# EAGLE design 1-Wire_Sniffer_REV1 (EAGLE 6.5.0)
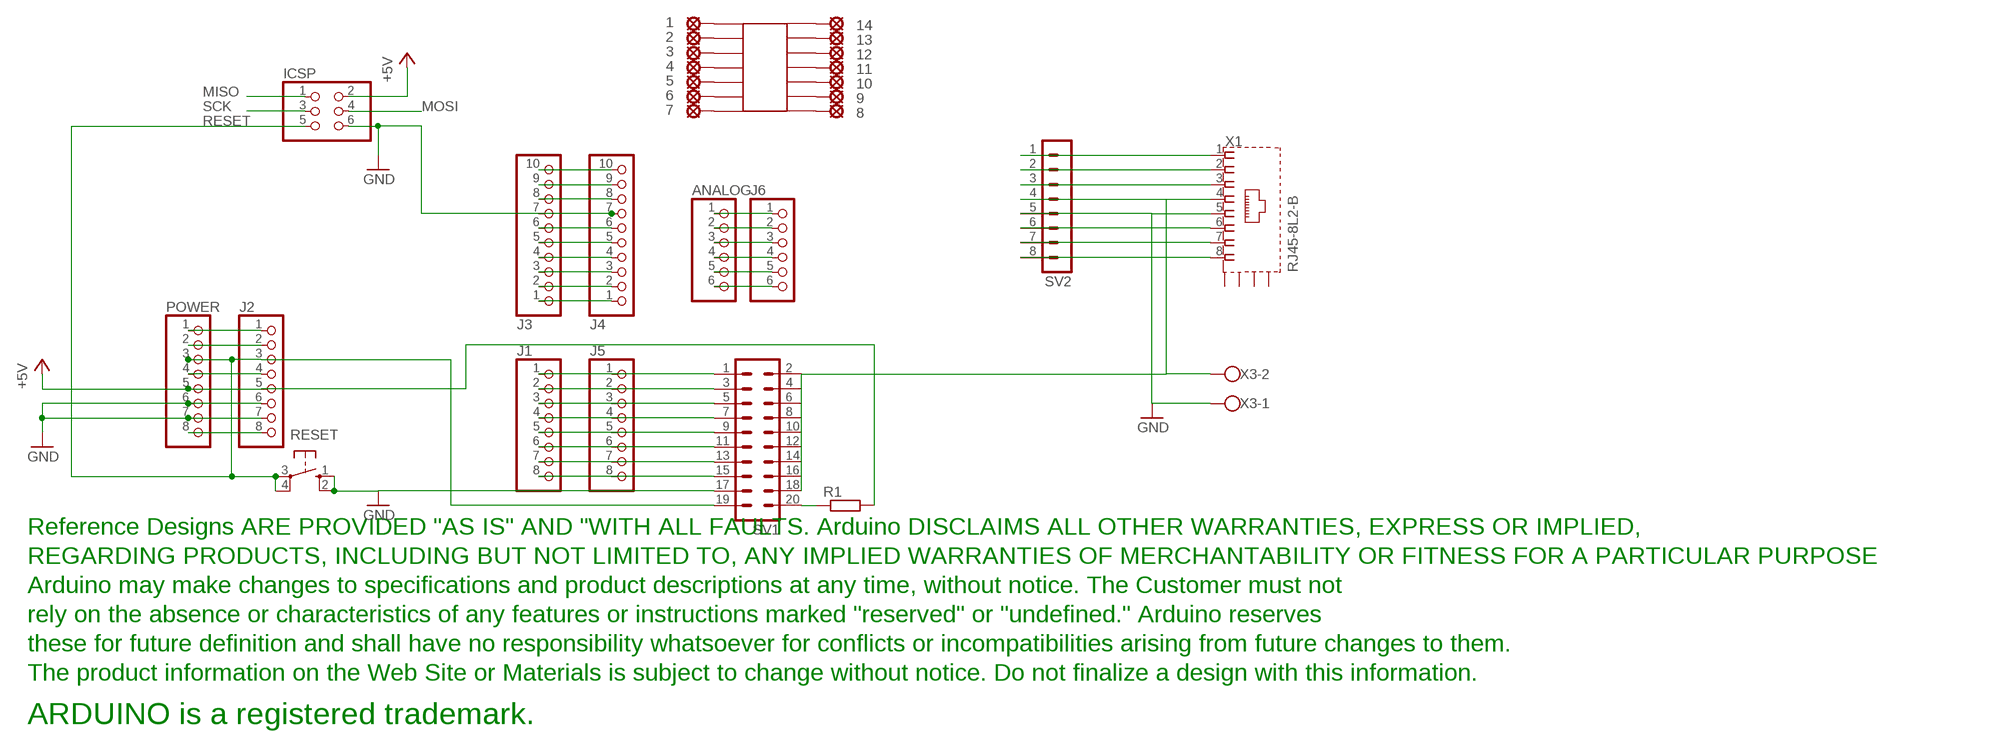
[diagram p0: schematic, sheet 1]

## Parts
1  LSP10  [LSP10]
2  LSP10  [LSP10]
3  LSP10  [LSP10]
4  LSP10  [LSP10]
5  LSP10  [LSP10]
6  LSP10  [LSP10]
7  LSP10  [LSP10]
8  LSP10  [LSP10]
9  LSP10  [LSP10]
10  LSP10  [LSP10]
11  LSP10  [LSP10]
12  LSP10  [LSP10]
13  LSP10  [LSP10]
14  LSP10  [LSP10]
ANALOG  PINHD-1X6  [1X06]
IC2  SMD-14  [SO-14NMW]
ICSP  PINHD-2X3  [2X03]
J1  PINHD-1X8TH  [1X08-TH]
J2  PINHD-1X8TH  [1X08-TH]
J3  PINHD-1X10TH  [1X10-TH]
J4  PINHD-1X10TH  [1X10-TH]
J5  PINHD-1X8TH  [1X08-TH]
J6  PINHD-1X6  [1X06]
POWER  PINHD-1X8TH  [1X08-TH]
R1  R-EU_0207/10  [0207/10]
RESET  10-XX  [B3F-10XX]
SV1  MA10-2  [MA10-2]
SV2  MA08-1  [MA08-1]
U$1  DISCLAIMER  [DISCLAIMER]
X1  RJ45-8L2-B  [RJ45-SHIELD2]
X3  W237-102  [W237-102]

## Nets
+5V: ICSP.2 J2.5 POWER.5 R1.2
+9V: J2.8 POWER.8
GND: ICSP.6 J2.7 J3.7 J4.7 POWER.7 RESET.1(S) RESET.2(S1) SV1.17 SV2.5 X1.5 X3.1
MISO: ICSP.1
MOSI: ICSP.4
N$1: J3.6 J4.6
N$2: J3.1 J4.1
N$3: J3.4 J4.4
N$4: J3.5 J4.5
N$5: SV1.2 SV1.4 SV1.6 SV1.8 SV1.10 SV1.12 SV1.14 SV1.16 SV1.18 SV2.4 X1.4 X3.2
N$6: J3.2 J4.2
N$7: J3.3 J4.3
N$8: J1.1 J5.1 SV1.1
N$9: J1.2 J5.2 SV1.3
N$10: J1.3 J5.3 SV1.5
N$11: J1.4 J5.4 SV1.7
N$12: J1.5 J5.5 SV1.9
N$13: J1.6 J5.6 SV1.11
N$14: J1.7 J5.7 SV1.13
N$15: J1.8 J5.8 SV1.15
N$16: SV2.1 X1.1
N$17: SV2.2 X1.2
N$18: ANALOG.1 J6.1
N$19: ANALOG.2 J6.2
N$20: ANALOG.3 J6.3
N$21: ANALOG.4 J6.4
N$22: ANALOG.5 J6.5
N$23: ANALOG.6 J6.6
N$24: 14.MP IC2.P$14
N$25: SV2.3 X1.3
N$31: J2.2 POWER.2
N$32: J2.1 POWER.1
N$38: SV2.6 X1.6
N$50: SV2.7 X1.7
N$52: SV2.8 X1.8
N$97: 13.MP IC2.P$13
N$98: 12.MP IC2.P$12
N$99: 11.MP IC2.P$11
N$100: 10.MP IC2.P$10
N$101: 9.MP IC2.P$9
N$102: 8.MP IC2.P$8
N$103: 7.MP IC2.P$7
N$104: 6.MP IC2.P$6
N$109: 5.MP IC2.P$5
N$110: 3.MP IC2.P$3
N$111: 2.MP IC2.P$2
N$112: 1.MP IC2.P$1
N$113: 4.MP IC2.P$4
N$141: J3.9 J4.9
N$142: J3.10 J4.10
N$144: R1.1 SV1.20
N$145: J2.6 POWER.6
N$222: J3.8 J4.8
N$223: J2.4 POWER.4
RESET: ICSP.5 J2.3 POWER.3 RESET.3(P) RESET.4(P1) SV1.19
SCK: ICSP.3
Unconnected: X1.S1(S) X1.S2(S) X1.S3(S) X1.S4(S)

## Library data of the parts
1-14 = SmartPrj:LSP10: SOLDER PAD drill 1.0 mm, distributor Buerklin, 12H555
ANALOG J6 = pinhead:PINHD-1X6: PIN HEADER
IC2 = carduino:SMD-14
ICSP = SmartPrj:PINHD-2X3: PIN HEADER
J1 J2 J5 POWER = SmartPrj:PINHD-1X8: PIN HEADER
J3 J4 = SmartPrj:PINHD-1X10: PIN HEADER
R1 = rcl:R-EU_: RESISTOR, European symbol
RESET = switch-omron:10-XX: OMRON SWITCH
SV1 = con-lstb:MA10-2: PIN HEADER; OC_FARNELL: unknown; OC_NEWARK: unknown
SV2 = con-lstb:MA08-1: PIN HEADER; OC_FARNELL: unknown; OC_NEWARK: unknown
U$1 = SmartPrj:DISCLAIMER
X1 = con-tycoelectronics:RJ45*2: RJ45 Low Profile Shield Type 2 For all RJ45 L, LC, LCT and X Series Models Source: www.tycoelectronics.com .. ENG_DS_1654001_1099_RJ_L_0507.pdf; MF: TYCO ELECTRONICS; MPN: RJ45-8L2-B; OC_FARNELL: unknown; OC_NEWARK: 52K3810
X3 = con-wago-500:W237-102: WAGO SCREW CLAMP; MPN: 237-102; OC_FARNELL: unknown; OC_NEWARK: 70K9898

## Board
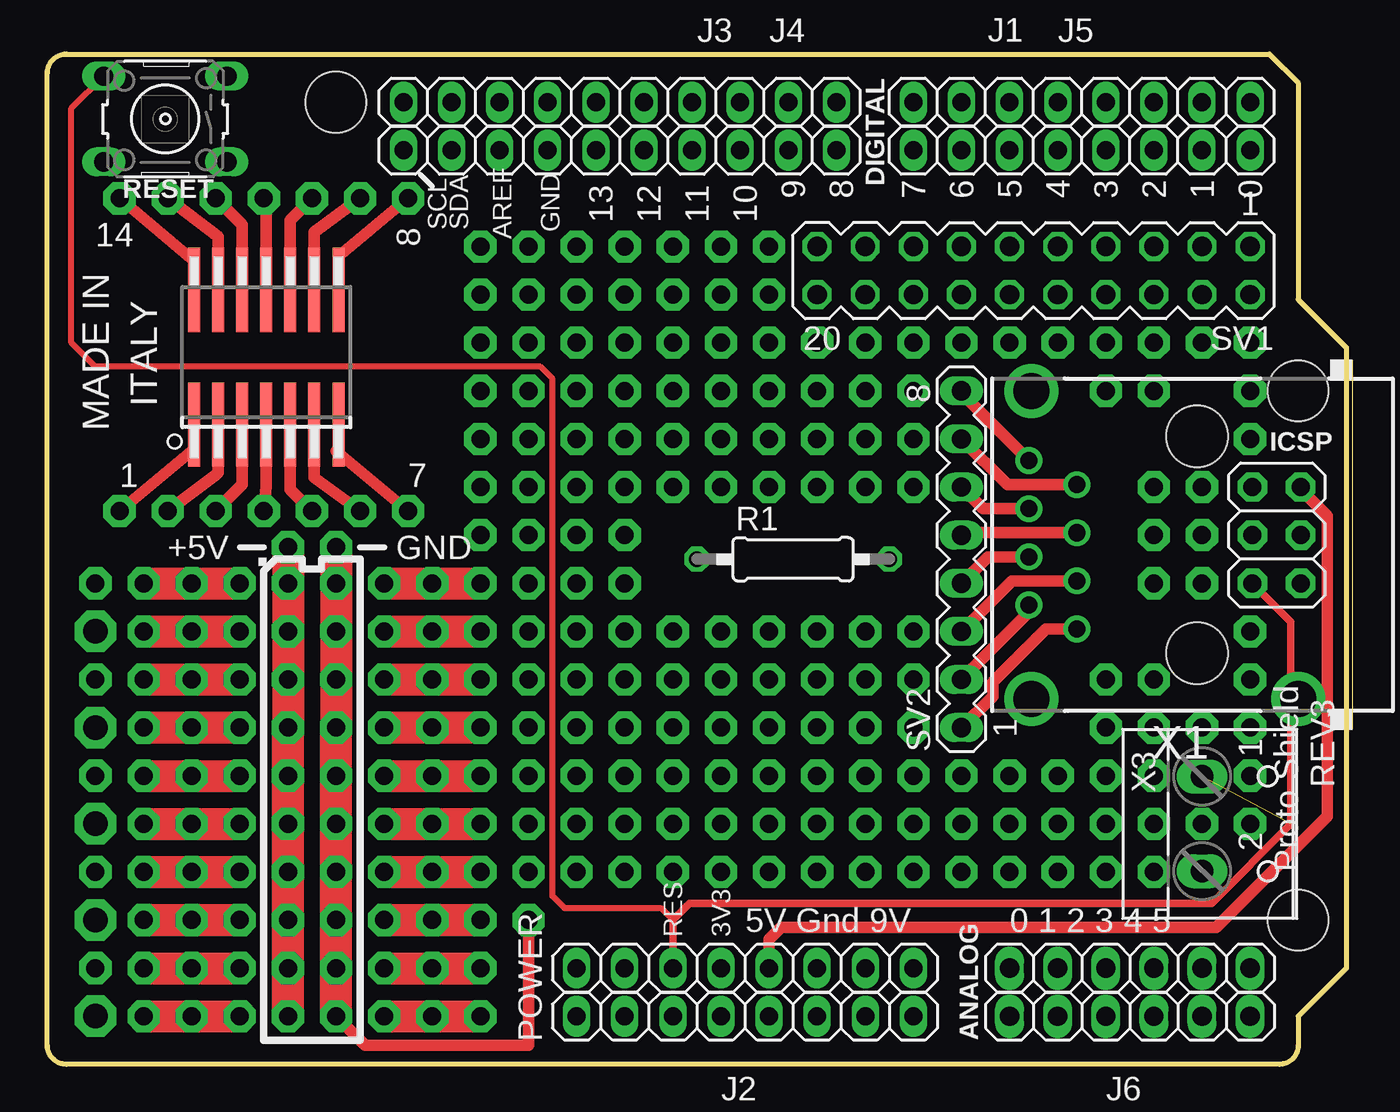
[diagram p1: board, top side]
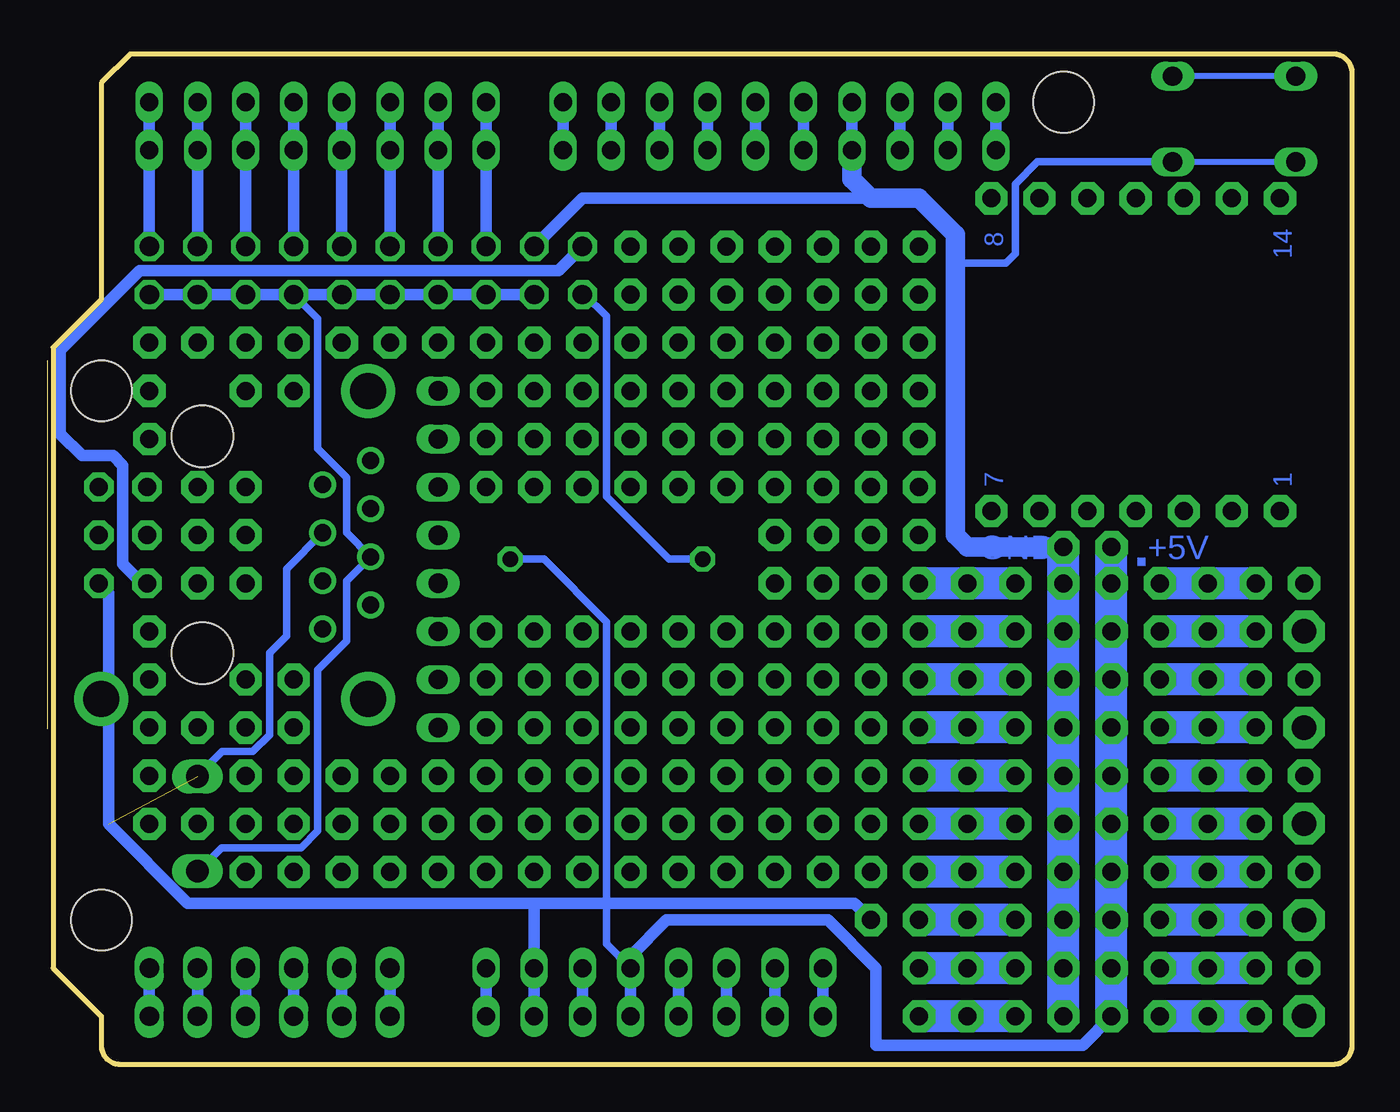
[diagram p2: board, bottom side, seen from below]

Size 68.58 x 53.34 mm. Coordinates in mm from the lower left corner, seen from the top.
Outline: 64.52,53.34 66.04,51.82 66.04,40.39 68.58,37.85 68.58,5.08 66.04,2.54 66.04,1 arc-90 65.04,0 1,0 arc-90 0,1 0,52.34 arc-90 1,53.34 64.52,53.34
Copper layers (1*16): Top 0.035mm / dielectric 1.5mm / Bottom 0.035mm
Design rules "default *": minimum track width 10mil, minimum drill 24mil, track to track 8mil, track to pad 8mil, pad to pad 8mil, via to via 8mil, smd to smd 8mil, copper to edge 40mil, drill to drill 8mil, minimum pad ring 10mil, minimum via ring 8mil, stop-mask expansion 2mil, vias tented up to drill 0mil, thermal gap 10mil
Holes 3.2 mm at 15.24,50.8 66.04,7.62 66.04,35.56

### Footprints (pad centres in the part's own frame; a part is rotated, then mirrored left to right if it is on the bottom)
LSP10 = drill 0.95 pad 1.7 octagon: MP 0,0
1X06 = drill 1.016 long: 1 -6.35,0; 2 -3.81,0; 3 -1.27,0; 4 1.27,0; 5 3.81,0; 6 6.35,0
SO-14NMW = smd 0.635 x 4.445: P$1 -3.048,-3.683; P$2 -1.778,-3.683; P$3 -0.508,-3.683; P$4 0.762,-3.683; P$5 2.032,-3.683; P$6 3.302,-3.683; P$7 4.572,-3.683; P$8 4.572,3.429; P$9 3.302,3.429; P$10 2.032,3.429; P$11 0.762,3.429; P$12 -0.508,3.429; P$13 -1.778,3.429; P$14 -3.048,3.429
2X03 = drill 0.95 pad 1.55 octagon: 1 -2.54,-1.27; 2 -2.54,1.27; 3 0,-1.27; 4 0,1.27; 5 2.54,-1.27; 6 2.54,1.27
1X08-TH = drill 0.95 pad 1.422 long: 1 -8.89,0; 2 -6.35,0; 3 -3.81,0; 4 -1.27,0; 5 1.27,0; 6 3.81,0; 7 6.35,0; 8 8.89,0
1X10-TH = drill 0.95 pad 1.422 long: 1 -11.43,0; 2 -8.89,0; 3 -6.35,0; 4 -3.81,0; 5 -1.27,0; 6 1.27,0; 7 3.81,0; 8 6.35,0; 9 8.89,0; 10 11.43,0
0207/10 = drill 0.813 octagon: 1 -5.08,0; 2 5.08,0
B3F-10XX = drill 1.016 long: 1 -3.251,2.261; 2 3.251,2.261; 3 -3.251,-2.261; 4 3.251,-2.261
MA10-2 = drill 1.016 octagon: 1 -11.43,-1.27; 2 -11.43,1.27; 3 -8.89,-1.27; 4 -8.89,1.27; 5 -6.35,-1.27; 6 -6.35,1.27; 7 -3.81,-1.27; 8 -3.81,1.27; 9 -1.27,-1.27; 10 -1.27,1.27; 11 1.27,-1.27; 12 1.27,1.27; 13 3.81,-1.27; 14 3.81,1.27; 15 6.35,-1.27; 16 6.35,1.27; 17 8.89,-1.27; 18 8.89,1.27; 19 11.43,-1.27; 20 11.43,1.27
MA08-1 = drill 1.016 long: 1 -8.89,0; 2 -6.35,0; 3 -3.81,0; 4 -1.27,0; 5 1.27,0; 6 3.81,0; 7 6.35,0; 8 8.89,0
RJ45-SHIELD2 = drill 0.9 pad 1.4: 1 -4.445,6.35; 2 -3.175,8.89; 3 -1.905,6.35; 4 -0.635,8.89; 5 0.635,6.35; 6 1.905,8.89; 7 3.175,6.35; 8 4.445,8.89 | drill 1.9 pad 2.5: S1 -8.128,-5.33; S2 8.128,-5.33; S3 -8.128,8.76; S4 8.128,8.76 | hole 3.251: -5.715,0; 5.715,0
W237-102 = drill 1.194 long: 1 -2.5,-1.27; 2 2.5,-1.27

### Placement (x,y rotation side)
1  3.81,29.21 90 top
2  6.35,29.21 90 top
3  8.89,29.21 90 top
4  11.43,29.21 90 top
5  13.97,29.21 90 top
6  16.51,29.21 90 top
7  19.05,29.21 90 top
8  19.05,45.72 90 top
9  16.51,45.72 90 top
10  13.97,45.72 90 top
11  11.43,45.72 90 top
12  8.89,45.72 90 top
13  6.35,45.72 270 top
14  3.81,45.72 270 top
ANALOG  57.15,2.54 0 top
IC2  10.79,37.47 0 top
ICSP  64.9,27.94 270 top
J1  54.61,50.8 180 top
J2  36.83,2.54 0 top
J3  30.23,50.8 180 top
J4  30.23,48.26 180 top
J5  54.61,48.26 180 top
J6  57.15,5.08 0 top
POWER  36.83,5.08 0 top
R1  39.37,26.67 0 top
RESET  6.22,49.91 180 top
SV1  52.07,41.91 180 top
SV2  48.26,26.67 90 top
U$1  -5.97,-23.11 0 top  (outside the outline)
X1  60.71,27.43 90 top
X3  62.23,12.7 270 top

### Tracks (layer width: path | path; a pad name or v marks a point on that pad's centre or on a via)
+5V  (via drill 0.95 pad 1.7)
  Top 0.61: ICSP.2 66.17,30.35 67.56,28.96 67.56,13.08 61.72,7.24 38.73,7.24 38.1,6.6 POWER.5
  Top 1.676: v12.7,2.54 v12.7,5.08 v12.7,7.62 v12.7,10.16 v12.7,12.7 v12.7,15.24 v12.7,17.78 v12.7,20.32 v12.7,22.86 v12.7,25.4 v12.7,27.3
  Bottom 0.406: R1.2 42.67,26.67 39.37,23.37 39.37,6.35 POWER.5
  Bottom 0.61: v12.7,2.54 14.22,1.02 25.15,1.02 25.15,5.08 27.69,7.62 36.2,7.62 38.1,5.71 POWER.5 J2.5
  Bottom 1.676: v12.7,2.54 v12.7,27.3
+9V
  Bottom 0.61: J2.8 POWER.8
GND  (via drill 0.95 pad 1.7)  (1 unrouted)
  Top 0.61: v15.24,2.54 16.76,1.02 25.4,1.02 v25.4,7.62 | X1.5 48.39,28.07 SV2.5
  Top 1.676: v15.24,2.54 v15.24,5.08 v15.24,7.62 v15.24,10.16 v15.24,12.7 v15.24,15.24 v15.24,17.78 v15.24,20.32 v15.24,22.86 v15.24,25.4 v15.24,27.3
  Bottom 0.305: RESET.1 RESET.2
  Bottom 0.406: RESET.1 16.61,47.65 17.78,46.48 17.78,42.8 18.29,42.29 20.95,42.29 | X1.5 56.26,26.16 56.26,22.61 57.15,21.72 57.15,17.4 58.04,16.51 59.65,16.51 X3.1
  Bottom 0.61: v25.4,7.62 26.29,8.51 43.18,8.51 | 43.18,8.51 61.47,8.51 65.66,12.7 65.66,24.89 ICSP.6 | J4.7 J3.7 | J2.7 POWER.7 43.18,8.51 | SV1.17 40.64,45.72 24.26,45.72
  Bottom 1.016: J4.7 26.42,46.74 25.4,45.72 24.26,45.72 22.86,45.72 20.95,43.81 20.95,42.29 20.95,27.94 20.32,27.3 v15.24,27.3
  Bottom 1.676: v15.24,2.54 v15.24,27.3
N$1
  Bottom 0.61: J4.6 J3.6
N$2
  Bottom 0.61: J4.1 J3.1
N$3
  Bottom 0.61: J4.4 J3.4
N$4
  Bottom 0.61: J4.5 J3.5
N$5
  Top 0.61: X1.4 49.66,26.8 SV2.4
  Bottom 0.406: SV1.8 54.61,39.37 54.61,32.51 53.09,30.99 53.09,28.07 X1.4 53.09,25.53 53.09,22.35 54.61,20.83 54.61,12.32 55.5,11.43 59.69,11.43 60.92,10.2 X3.2
  Bottom 0.61: SV1.18 SV1.16 SV1.14 SV1.12 SV1.10 SV1.8 SV1.6 SV1.4 SV1.2
N$6
  Bottom 0.61: J4.2 J3.2
N$7
  Bottom 0.61: J4.3 J3.3
N$8
  Bottom 0.61: J1.1 J5.1 SV1.1
N$9
  Bottom 0.61: J1.2 J5.2 SV1.3
N$10
  Bottom 0.61: J1.3 J5.3 SV1.5
N$11
  Bottom 0.61: J1.4 J5.4 SV1.7
N$12
  Bottom 0.61: J1.5 J5.5 SV1.9
N$13
  Bottom 0.61: J1.6 J5.6 SV1.11
N$14
  Bottom 0.61: J1.7 J5.7 SV1.13
N$15
  Bottom 0.61: J1.8 J5.8 SV1.15
N$16
  Top 0.61: X1.1 52.7,22.99 49.91,20.19 49.91,19.43 SV2.1
N$17
  Top 0.61: X1.2 51.82,23.88 SV2.2
N$18
  Bottom 0.61: ANALOG.1 J6.1
N$19
  Bottom 0.61: ANALOG.2 J6.2
N$20
  Bottom 0.61: ANALOG.3 J6.3
N$21
  Bottom 0.61: ANALOG.4 J6.4
N$22
  Bottom 0.61: ANALOG.5 J6.5
N$23
  Bottom 0.61: ANALOG.6 J6.6
N$24
  Top 0.61: IC2.P$14 7.75,42.42 14.MP
N$25
  Top 0.61: X1.3 50.93,25.53 SV2.3
N$27  (via drill 0.95 pad 1.7)
  Top 1.676: v17.78,5.08 v22.86,5.08
N$28  (via drill 0.95 pad 1.7)
  other vias: 20.32,5.08
N$29  (via drill 1.3 pad 2.18)
  other vias: 2.54,17.78
N$30  (via drill 0.95 pad 1.7)
  other vias: 2.54,25.4
N$31
  Bottom 0.61: J2.2 POWER.2
N$32
  Bottom 0.61: J2.1 POWER.1
N$33  (via drill 0.95 pad 1.7)
  other vias: 7.62,5.08
N$34  (via drill 0.95 pad 1.7)
  Top 1.676: v5.08,5.08 v10.16,5.08
N$35  (via drill 1.3 pad 2.18)
  other vias: 2.54,22.86
N$36  (via drill 0.95 pad 1.7)
  other vias: 20.32,7.62
N$37  (via drill 0.95 pad 1.7)
  Top 1.676: v17.78,7.62 v22.86,7.62
N$38
  Top 0.61: X1.6 49.4,29.34 SV2.6
N$39  (via drill 0.95 pad 1.7)
  other vias: 58.42,30.48
N$40  (via drill 0.95 pad 1.7)
  other vias: 2.54,5.08
N$41  (via drill 0.95 pad 1.7)
  Top 1.676: v5.08,7.62 v10.16,7.62
N$42  (via drill 0.95 pad 1.7)
  other vias: 7.62,7.62
N$43  (via drill 0.95 pad 1.7)
  other vias: 58.42,27.94
N$44  (via drill 1.3 pad 2.18)
  other vias: 2.54,7.62
N$45  (via drill 0.95 pad 1.7)
  other vias: 45.72,10.16
N$46  (via drill 0.95 pad 1.7)
  other vias: 27.94,10.16
N$47  (via drill 0.95 pad 1.7)
  other vias: 25.4,10.16
N$48  (via drill 0.95 pad 1.7)
  Top 1.676: v17.78,10.16 v22.86,10.16
N$49  (via drill 0.95 pad 1.7)
  other vias: 20.32,10.16
N$50
  Top 0.61: X1.7 50.67,30.61 SV2.7
N$51  (via drill 0.95 pad 1.7)
  other vias: 58.42,25.4
N$52
  Top 0.61: X1.8 48.26,35.43 SV2.8
N$54  (via drill 0.95 pad 1.7)
  other vias: 7.62,10.16
N$55  (via drill 0.95 pad 1.7)
  Top 1.676: v5.08,10.16 v10.16,10.16
N$56  (via drill 0.95 pad 1.7)
  other vias: 2.54,10.16
N$57  (via drill 0.95 pad 1.7)
  other vias: 53.34,12.7
N$58  (via drill 0.95 pad 1.7)
  other vias: 27.94,12.7
N$59  (via drill 0.95 pad 1.7)
  other vias: 25.4,12.7
N$60
  Bottom 1.676: 17.78,5.08 22.86,5.08
N$61  (via drill 0.95 pad 1.7)
  other vias: 20.32,12.7
N$62  (via drill 0.95 pad 1.7)
  Top 1.676: v17.78,12.7 v22.86,12.7
N$63  (via drill 0.95 pad 1.7)
  other vias: 22.86,27.94
N$64  (via drill 0.95 pad 1.7)
  other vias: 22.86,30.48
N$65  (via drill 0.95 pad 1.7)
  Top 1.676: v5.08,12.7 v10.16,12.7
N$66  (via drill 0.95 pad 1.7)
  other vias: 7.62,12.7
N$67  (via drill 0.95 pad 1.7)
  Top 1.676: v5.08,22.86 v10.16,22.86
N$68  (via drill 1.3 pad 2.18)
  other vias: 2.54,12.7
N$69  (via drill 0.95 pad 1.7)
  other vias: 43.18,15.24
N$70  (via drill 0.95 pad 1.7)
  other vias: 27.94,15.24
N$71  (via drill 0.95 pad 1.7)
  other vias: 25.4,15.24
N$72  (via drill 0.95 pad 1.7)
  Top 1.676: v17.78,15.24 v22.86,15.24
N$73  (via drill 0.95 pad 1.7)
  other vias: 20.32,15.24
N$74  (via drill 0.95 pad 1.7)
  other vias: 7.62,22.86
N$75  (via drill 0.95 pad 1.7)
  other vias: 7.62,20.32
N$76  (via drill 0.95 pad 1.7)
  Top 1.676: v22.86,22.86 v20.32,22.86 v17.78,22.86
N$77  (via drill 0.95 pad 1.7)
  Top 1.676: v22.86,20.32 v20.32,20.32 v17.78,20.32
N$78  (via drill 0.95 pad 1.7)
  other vias: 7.62,15.24
N$79  (via drill 0.95 pad 1.7)
  Top 1.676: v5.08,15.24 v10.16,15.24
N$80  (via drill 0.95 pad 1.7)
  other vias: 2.54,15.24
N$81  (via drill 0.95 pad 1.7)
  other vias: 58.42,17.78
N$82  (via drill 0.95 pad 1.7)
  other vias: 27.94,17.78
N$83  (via drill 0.95 pad 1.7)
  other vias: 25.4,17.78
N$84  (via drill 0.95 pad 1.7)
  Top 1.676: v5.08,17.78 v10.16,17.78
N$85  (via drill 0.95 pad 1.7)
  other vias: 20.32,17.78
N$86  (via drill 0.95 pad 1.7)
  Top 1.676: v17.78,17.78 v22.86,17.78
N$87  (via drill 0.95 pad 1.7)
  Top 1.676: v5.08,20.32 v10.16,20.32
N$88  (via drill 0.95 pad 1.7)
  other vias: 22.86,33.02
N$89  (via drill 0.95 pad 1.7)
  other vias: 22.86,35.56
N$90  (via drill 0.95 pad 1.7)
  other vias: 7.62,17.78
N$91  (via drill 0.95 pad 1.7)
  other vias: 22.86,38.1
N$92  (via drill 0.95 pad 1.7)
  other vias: 2.54,20.32
N$94  (via drill 0.95 pad 1.7)
  other vias: 27.94,20.32
N$95  (via drill 0.95 pad 1.7)
  other vias: 25.4,20.32
N$96  (via drill 0.95 pad 1.7)
  other vias: 22.86,40.64
N$97
  Top 0.61: IC2.P$13 9.02,43.69 13.MP
N$98
  Top 0.61: IC2.P$12 10.29,44.32 12.MP
N$99
  Top 0.61: IC2.P$11 11.56,46.23 11.MP
N$100
  Top 0.61: IC2.P$10 12.83,44.58 10.MP
N$101
  Top 0.61: IC2.P$9 14.1,43.94 9.MP
N$102
  Top 0.61: IC2.P$8 15.37,42.67 8.MP
N$103
  Top 0.61: 7.MP 15.24,32.38 15.37,32.51 IC2.P$7
N$104
  Top 0.61: IC2.P$6 14.1,30.99 6.MP
N$105  (via drill 0.95 pad 1.7)
  other vias: 63.5,22.86
N$106  (via drill 0.95 pad 1.7)
  other vias: 27.94,22.86
N$107  (via drill 0.95 pad 1.7)
  other vias: 25.4,22.86
N$108  (via drill 0.95 pad 1.7)
  other vias: 22.86,43.18
N$109
  Top 0.61: IC2.P$5 12.83,30.35 5.MP
N$110
  Top 0.61: IC2.P$3 10.29,30.61 3.MP
N$111
  Top 0.61: 2.MP 8.89,31.11 9.02,31.24 IC2.P$2
N$112
  Top 0.61: 1.MP 7.62,32.38 7.75,32.51 IC2.P$1
N$113
  Top 0.61: IC2.P$4 11.56,30.48 4.MP
N$114
  Bottom 1.676: 5.08,25.4 10.16,25.4
N$115
  Bottom 1.676: 17.78,25.4 22.86,25.4
N$116
  Bottom 1.676: 17.78,22.86 22.86,22.86
N$117  (via drill 0.95 pad 1.7)
  other vias: 60.96,25.4
N$118  (via drill 0.95 pad 1.7)
  Top 1.676: v22.86,25.4 v20.32,25.4 v17.78,25.4
N$119  (via drill 0.95 pad 1.7)
  other vias: 27.94,25.4
N$120  (via drill 0.95 pad 1.7)
  other vias: 25.4,25.4
N$121
  Bottom 1.676: 17.78,20.32 22.86,20.32
N$122
  Bottom 1.676: 17.78,17.78 22.86,17.78
N$123  (via drill 0.95 pad 1.7)
  other vias: 25.4,43.18
N$124
  Bottom 1.676: 17.78,15.24 22.86,15.24
N$125
  Bottom 1.676: 17.78,12.7 22.86,12.7
N$126
  Bottom 1.676: 17.78,10.16 22.86,10.16
N$127
  Bottom 1.676: 5.08,5.08 10.16,5.08
N$128
  Bottom 1.676: 5.08,10.16 10.16,10.16
N$129
  Bottom 1.676: 5.08,12.7 10.16,12.7
N$130
  Bottom 1.676: 5.08,15.24 10.16,15.24
N$131  (via drill 0.95 pad 1.7)
  other vias: 27.94,27.94
N$132  (via drill 0.95 pad 1.7)
  other vias: 25.4,27.94
N$133
  Bottom 1.676: 5.08,17.78 10.16,17.78
N$134
  Bottom 1.676: 5.08,20.32 10.16,20.32
N$135  (via drill 0.95 pad 1.7)
  other vias: 25.4,30.48
N$136
  Bottom 1.676: 5.08,22.86 10.16,22.86
N$137
  Bottom 1.676: 5.08,7.62 10.16,7.62
N$138
  Bottom 1.676: 5.08,2.54 10.16,2.54
N$139
  Bottom 1.676: 17.78,7.62 22.86,7.62
N$140
  Bottom 1.676: 17.78,2.54 22.86,2.54
N$141
  Bottom 0.61: J4.9 J3.9
N$142
  Bottom 0.61: J4.10 J3.10
N$143  (via drill 0.95 pad 1.7)
  other vias: 27.94,30.48
N$144
  Bottom 0.406: SV1.20 40.51,40.64 39.37,39.5 39.37,29.97 36.07,26.67 R1.1
N$145
  Bottom 0.61: J2.6 POWER.6
N$155  (via drill 0.95 pad 1.7)
  other vias: 27.94,33.02
N$156  (via drill 0.95 pad 1.7)
  other vias: 25.4,33.02
N$167  (via drill 0.95 pad 1.7)
  other vias: 27.94,35.56
N$168  (via drill 0.95 pad 1.7)
  other vias: 25.4,35.56
N$177  (via drill 0.95 pad 1.7)
  other vias: 43.18,38.1
N$178  (via drill 0.95 pad 1.7)
  Top 1.676: v5.08,25.4 v10.16,25.4
N$179  (via drill 0.95 pad 1.7)
  other vias: 27.94,38.1
N$180  (via drill 0.95 pad 1.7)
  other vias: 25.4,38.1
N$190  (via drill 0.95 pad 1.7)
  other vias: 7.62,25.4
N$191  (via drill 0.95 pad 1.7)
  other vias: 27.94,40.64
N$192  (via drill 0.95 pad 1.7)
  other vias: 25.4,40.64
N$201  (via drill 0.95 pad 1.7)
  other vias: 38.1,43.18
N$203  (via drill 0.95 pad 1.7)
  other vias: 27.94,43.18
N$222
  Bottom 0.61: J4.8 J3.8
N$223
  Bottom 0.61: J2.4 POWER.4
N$227  (via drill 0.95 pad 1.7)
  other vias: 30.48,38.1
N$228  (via drill 0.95 pad 1.7)
  other vias: 33.02,38.1
N$229  (via drill 0.95 pad 1.7)
  other vias: 30.48,35.56
N$230  (via drill 0.95 pad 1.7)
  other vias: 33.02,35.56
N$231  (via drill 0.95 pad 1.7)
  other vias: 30.48,33.02
N$232  (via drill 0.95 pad 1.7)
  other vias: 33.02,33.02
N$233  (via drill 0.95 pad 1.7)
  other vias: 35.56,35.56
N$234  (via drill 0.95 pad 1.7)
  other vias: 35.56,33.02
N$235  (via drill 0.95 pad 1.7)
  other vias: 33.02,30.48
N$236  (via drill 0.95 pad 1.7)
  other vias: 35.56,30.48
N$237  (via drill 0.95 pad 1.7)
  other vias: 38.1,33.02
N$238  (via drill 0.95 pad 1.7)
  other vias: 38.1,35.56
N$239  (via drill 0.95 pad 1.7)
  other vias: 38.1,30.48
N$240  (via drill 0.95 pad 1.7)
  other vias: 40.64,33.02
N$241  (via drill 0.95 pad 1.7)
  other vias: 40.64,35.56
N$242  (via drill 0.95 pad 1.7)
  other vias: 38.1,38.1
N$243  (via drill 0.95 pad 1.7)
  other vias: 35.56,38.1
N$245  (via drill 0.95 pad 1.7)
  other vias: 33.02,40.64
N$246  (via drill 0.95 pad 1.7)
  other vias: 35.56,40.64
N$247  (via drill 0.95 pad 1.7)
  other vias: 30.48,40.64
N$248  (via drill 0.95 pad 1.7)
  other vias: 30.48,43.18
N$249  (via drill 0.95 pad 1.7)
  other vias: 33.02,43.18
N$251  (via drill 0.95 pad 1.7)
  other vias: 30.48,30.48
N$252  (via drill 0.95 pad 1.7)
  other vias: 30.48,27.94
N$259  (via drill 0.95 pad 1.7)
  other vias: 33.02,22.86
N$261  (via drill 0.95 pad 1.7)
  other vias: 35.56,22.86
N$262  (via drill 0.95 pad 1.7)
  other vias: 38.1,22.86
N$263  (via drill 0.95 pad 1.7)
  other vias: 40.64,22.86
N$267  (via drill 0.95 pad 1.7)
  other vias: 43.18,30.48
N$268  (via drill 0.95 pad 1.7)
  other vias: 40.64,30.48
N$269  (via drill 0.95 pad 1.7)
  other vias: 45.72,30.48
N$271  (via drill 0.95 pad 1.7)
  other vias: 30.48,25.4
N$272  (via drill 0.95 pad 1.7)
  other vias: 30.48,22.86
N$273  (via drill 0.95 pad 1.7)
  other vias: 30.48,20.32
N$274  (via drill 0.95 pad 1.7)
  other vias: 33.02,15.24
N$275  (via drill 0.95 pad 1.7)
  other vias: 33.02,17.78
N$276  (via drill 0.95 pad 1.7)
  other vias: 38.1,17.78
N$277  (via drill 0.95 pad 1.7)
  other vias: 35.56,17.78
N$278  (via drill 0.95 pad 1.7)
  other vias: 35.56,15.24
N$279  (via drill 0.95 pad 1.7)
  other vias: 30.48,15.24
N$280  (via drill 0.95 pad 1.7)
  other vias: 30.48,17.78
N$281  (via drill 0.95 pad 1.7)
  other vias: 38.1,20.32
N$282  (via drill 0.95 pad 1.7)
  other vias: 40.64,20.32
N$283  (via drill 0.95 pad 1.7)
  other vias: 38.1,15.24
N$284  (via drill 0.95 pad 1.7)
  other vias: 30.48,12.7
N$285  (via drill 0.95 pad 1.7)
  other vias: 33.02,12.7
N$286  (via drill 0.95 pad 1.7)
  other vias: 30.48,10.16
N$289  (via drill 0.95 pad 1.7)
  other vias: 33.02,10.16
N$290  (via drill 0.95 pad 1.7)
  other vias: 35.56,10.16
N$291  (via drill 0.95 pad 1.7)
  other vias: 35.56,12.7
N$292  (via drill 0.95 pad 1.7)
  other vias: 38.1,12.7
N$293  (via drill 0.95 pad 1.7)
  other vias: 40.64,17.78
N$294  (via drill 0.95 pad 1.7)
  other vias: 43.18,17.78
N$295  (via drill 0.95 pad 1.7)
  other vias: 43.18,20.32
N$296  (via drill 0.95 pad 1.7)
  other vias: 45.72,20.32
N$297  (via drill 0.95 pad 1.7)
  other vias: 45.72,22.86
N$298  (via drill 0.95 pad 1.7)
  other vias: 43.18,22.86
N$307  (via drill 0.95 pad 1.7)
  other vias: 45.72,33.02
N$311  (via drill 0.95 pad 1.7)
  other vias: 43.18,33.02
N$312  (via drill 0.95 pad 1.7)
  other vias: 43.18,35.56
N$313  (via drill 0.95 pad 1.7)
  other vias: 45.72,35.56
N$314  (via drill 0.95 pad 1.7)
  other vias: 33.02,20.32
N$315  (via drill 0.95 pad 1.7)
  other vias: 35.56,20.32
N$316  (via drill 0.95 pad 1.7)
  other vias: 45.72,17.78
N$320  (via drill 0.95 pad 1.7)
  other vias: 55.88,20.32
N$321  (via drill 0.95 pad 1.7)
  other vias: 63.5,20.32
N$322  (via drill 0.95 pad 1.7)
  other vias: 63.5,17.78
N$323  (via drill 0.95 pad 1.7)
  other vias: 60.96,17.78
N$324  (via drill 0.95 pad 1.7)
  other vias: 63.5,15.24
N$325  (via drill 0.95 pad 1.7)
  other vias: 63.5,12.7
N$326  (via drill 0.95 pad 1.7)
  other vias: 60.96,12.7
N$327  (via drill 0.95 pad 1.7)
  other vias: 58.42,12.7
N$329  (via drill 1.3 pad 2.18)
  other vias: 2.54,2.54
N$331  (via drill 0.95 pad 1.7)
  other vias: 7.62,2.54
N$332  (via drill 0.95 pad 1.7)
  Top 1.676: v5.08,2.54 v10.16,2.54
N$335  (via drill 0.95 pad 1.7)
  Top 1.676: v17.78,2.54 v22.86,2.54
N$336  (via drill 0.95 pad 1.7)
  other vias: 20.32,2.54
N$354  (via drill 0.95 pad 1.7)
  other vias: 58.42,10.16
N$355  (via drill 0.95 pad 1.7)
  other vias: 55.88,10.16
N$356  (via drill 0.95 pad 1.7)
  other vias: 53.34,10.16
N$357  (via drill 0.95 pad 1.7)
  other vias: 50.8,10.16
N$358  (via drill 0.95 pad 1.7)
  other vias: 48.26,10.16
N$359  (via drill 0.95 pad 1.7)
  other vias: 40.64,10.16
N$360  (via drill 0.95 pad 1.7)
  other vias: 38.1,10.16
N$361  (via drill 0.95 pad 1.7)
  other vias: 43.18,10.16
N$362  (via drill 0.95 pad 1.7)
  other vias: 43.18,12.7
N$363  (via drill 0.95 pad 1.7)
  other vias: 40.64,12.7
N$364  (via drill 0.95 pad 1.7)
  other vias: 45.72,12.7
N$365  (via drill 0.95 pad 1.7)
  other vias: 48.26,12.7
N$366  (via drill 0.95 pad 1.7)
  other vias: 55.88,12.7
N$367  (via drill 0.95 pad 1.7)
  other vias: 50.8,12.7
N$369  (via drill 0.95 pad 1.7)
  other vias: 58.42,15.24
N$370  (via drill 0.95 pad 1.7)
  other vias: 55.88,15.24
N$371  (via drill 0.95 pad 1.7)
  other vias: 53.34,15.24
N$372  (via drill 0.95 pad 1.7)
  other vias: 50.8,15.24
N$373  (via drill 0.95 pad 1.7)
  other vias: 48.26,15.24
N$374  (via drill 0.95 pad 1.7)
  other vias: 45.72,15.24
N$375  (via drill 0.95 pad 1.7)
  other vias: 40.64,15.24
N$379  (via drill 0.95 pad 1.7)
  other vias: 55.88,17.78
N$380  (via drill 0.95 pad 1.7)
  other vias: 58.42,20.32
N$393  (via drill 0.95 pad 1.7)
  other vias: 60.96,27.94
N$396  (via drill 0.95 pad 1.7)
  other vias: 60.96,30.48
N$397  (via drill 0.95 pad 1.7)
  other vias: 63.5,33.02
N$401  (via drill 0.95 pad 1.7)
  other vias: 63.5,35.56
N$402  (via drill 0.95 pad 1.7)
  other vias: 58.42,35.56
N$404  (via drill 0.95 pad 1.7)
  other vias: 63.5,38.1
N$405  (via drill 0.95 pad 1.7)
  other vias: 60.96,38.1
N$406  (via drill 0.95 pad 1.7)
  other vias: 58.42,38.1
N$407  (via drill 0.95 pad 1.7)
  other vias: 55.88,38.1
N$408  (via drill 0.95 pad 1.7)
  other vias: 55.88,35.56
N$409  (via drill 0.95 pad 1.7)
  other vias: 53.34,38.1
N$412  (via drill 0.95 pad 1.7)
  other vias: 50.8,38.1
N$413  (via drill 0.95 pad 1.7)
  other vias: 48.26,38.1
N$414  (via drill 0.95 pad 1.7)
  other vias: 45.72,38.1
N$415  (via drill 0.95 pad 1.7)
  other vias: 40.64,38.1
N$416  (via drill 0.95 pad 1.7)
  other vias: 38.1,40.64
N$436  (via drill 0.95 pad 1.7)
  other vias: 35.56,43.18
RESET
  Top 0.305: 33.02,7.62 32.38,8.26 27.3,8.26 26.67,8.89 26.67,36.2 26.04,36.83 2.54,36.83 1.27,38.1 1.27,50.47 RESET.4
  Top 0.406: ICSP.5 65.66,23.37 65.66,12.7 61.47,8.51 33.91,8.51 33.02,7.62 POWER.3
  Bottom 0.305: RESET.4 RESET.3
  Bottom 0.61: POWER.3 J2.3 | ICSP.5 63.88,25.4 64.9,26.42 64.9,31.62 65.41,32.13 67.06,32.13 68.2,33.27 68.2,37.72 64.01,41.91 41.91,41.91 SV1.19

### Text on the board
Bottom: 14 | 8 | 1 | 7 | +5V | GND | .
tPlace: 9 | 8 | 7 | 6 | 5 | 4 | 3 | 2 | 1 | 0 | 13 | 12 | 11 | 10 | +5V | GND | . | REV3 | Proto Shield
tNames: DIGITAL | AREF | SCL | SDA | GND | ITALY | MADE IN | RES | 3V3 | 5V Gnd 9V | 0 1 2 3 4 5
bStop: DIGITAL | SDA | AREF | SCL | GND | 13 | 12 | 11 | 9 | 8 | 7 | 6 | 5 | 4 | 3 | 2 | 1 | 0 | 10 | 14 | 8 | 1 | 7 | 1 | 2 | 3 | 4 | +5V | GND | . | 5 | 6 | IOREF | RST | 3.3V | 5V | GND | GND | VIN | ANALOG | 0 | 1 | 2 | 3 | 4 | 5
Reference: USB | ETH